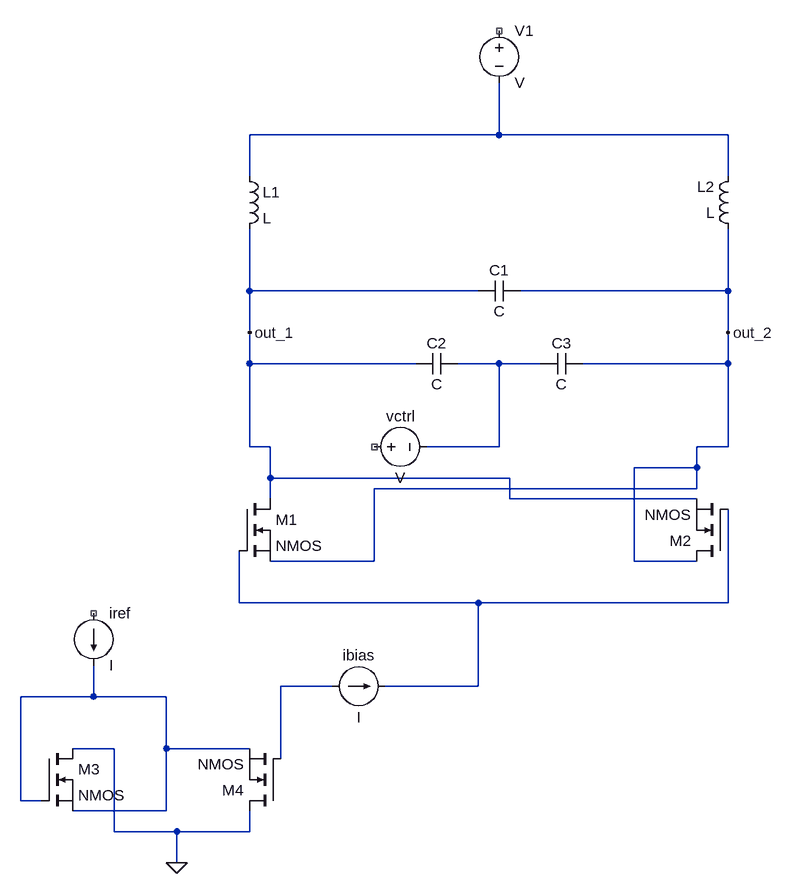
[diagram p0: schematic vco.asc]
vco.asc, the LTspice schematic file:
Version 4.1
SHEET 1 880 1348
WIRE 192 208 192 128
WIRE 192 208 -192 208
WIRE 544 208 192 208
WIRE -192 272 -192 208
WIRE 544 272 544 208
WIRE -192 448 -192 352
WIRE 160 448 -192 448
WIRE 544 448 544 352
WIRE 544 448 224 448
WIRE -192 512 -192 448
WIRE 544 512 544 448
WIRE -192 560 -192 512
WIRE 64 560 -192 560
WIRE 192 560 128 560
WIRE 256 560 192 560
WIRE 544 560 544 512
WIRE 544 560 320 560
WIRE -192 688 -192 560
WIRE -160 688 -192 688
WIRE 192 688 192 560
WIRE 192 688 80 688
WIRE 544 688 544 560
WIRE 544 688 496 688
WIRE 496 720 496 688
WIRE 496 720 400 720
WIRE -160 736 -160 688
WIRE 208 736 -160 736
WIRE 496 752 496 720
WIRE 496 752 0 752
WIRE -160 768 -160 736
WIRE 208 768 208 736
WIRE 496 768 208 768
WIRE 0 864 0 752
WIRE 0 864 -160 864
WIRE 400 864 400 720
WIRE 496 864 400 864
WIRE -208 928 -208 848
WIRE 160 928 -208 928
WIRE 544 928 544 784
WIRE 544 928 160 928
WIRE -64 1056 -144 1056
WIRE 160 1056 160 928
WIRE 160 1056 16 1056
WIRE -432 1072 -432 1024
WIRE -432 1072 -544 1072
WIRE -320 1072 -432 1072
WIRE -400 1152 -464 1152
WIRE -320 1152 -320 1072
WIRE -192 1152 -320 1152
WIRE -144 1168 -144 1056
WIRE -544 1232 -544 1072
WIRE -512 1232 -544 1232
WIRE -320 1248 -320 1152
WIRE -320 1248 -464 1248
WIRE -400 1280 -400 1152
WIRE -304 1280 -400 1280
WIRE -192 1280 -192 1248
WIRE -192 1280 -304 1280
WIRE -304 1328 -304 1280
FLAG -192 512 out_1
FLAG 544 512 out_2
FLAG -304 1328 0
SYMBOL voltage 192 32 R0
SYMATTR InstName V1
SYMBOL ind -208 256 R0
SYMATTR InstName L1
SYMBOL ind 560 368 R180
WINDOW 0 36 80 Left 2
WINDOW 3 36 40 Left 2
SYMATTR InstName L2
SYMBOL cap 224 432 R90
WINDOW 0 0 32 VBottom 2
WINDOW 3 32 32 VTop 2
SYMATTR InstName C1
SYMBOL cap 128 544 R90
WINDOW 0 0 32 VBottom 2
WINDOW 3 32 32 VTop 2
SYMATTR InstName C2
SYMBOL cap 320 544 R90
WINDOW 0 0 32 VBottom 2
WINDOW 3 32 32 VTop 2
SYMATTR InstName C3
SYMBOL voltage -16 688 R270
WINDOW 0 32 56 VTop 2
WINDOW 3 -32 56 VBottom 2
SYMATTR InstName vctrl
SYMBOL nmos -208 768 R0
SYMATTR InstName M1
SYMBOL nmos 544 864 R180
SYMATTR InstName M2
SYMBOL current -64 1056 R270
WINDOW 0 32 40 VTop 2
WINDOW 3 -32 40 VBottom 2
SYMATTR InstName ibias
SYMBOL nmos -512 1152 R0
SYMATTR InstName M3
SYMBOL nmos -144 1248 R180
SYMATTR InstName M4
SYMBOL current -432 944 R0
SYMATTR InstName iref

The netlist it stands for:
* vco.asc
V1 NC_01 N001 V
L1 N001 out_1 L
L2 out_2 N001 L
C1 out_2 out_1 C
C2 N002 out_1 C
C3 out_2 N002 C
vctrl NC_02 N002 V
M1 out_1 N003 out_2 out_2 NMOS
M2 out_2 N003 out_1 out_1 NMOS
ibias N004 N003 I
M3 0 N005 N005 N005 NMOS
M4 0 N004 N005 N005 NMOS
iref NC_03 N005 I
.model NMOS NMOS
.model PMOS PMOS
.lib standard.mos
.backanno
.end